# EAGLE design Pressure-Sensor-Module (EAGLE 9.3.1)
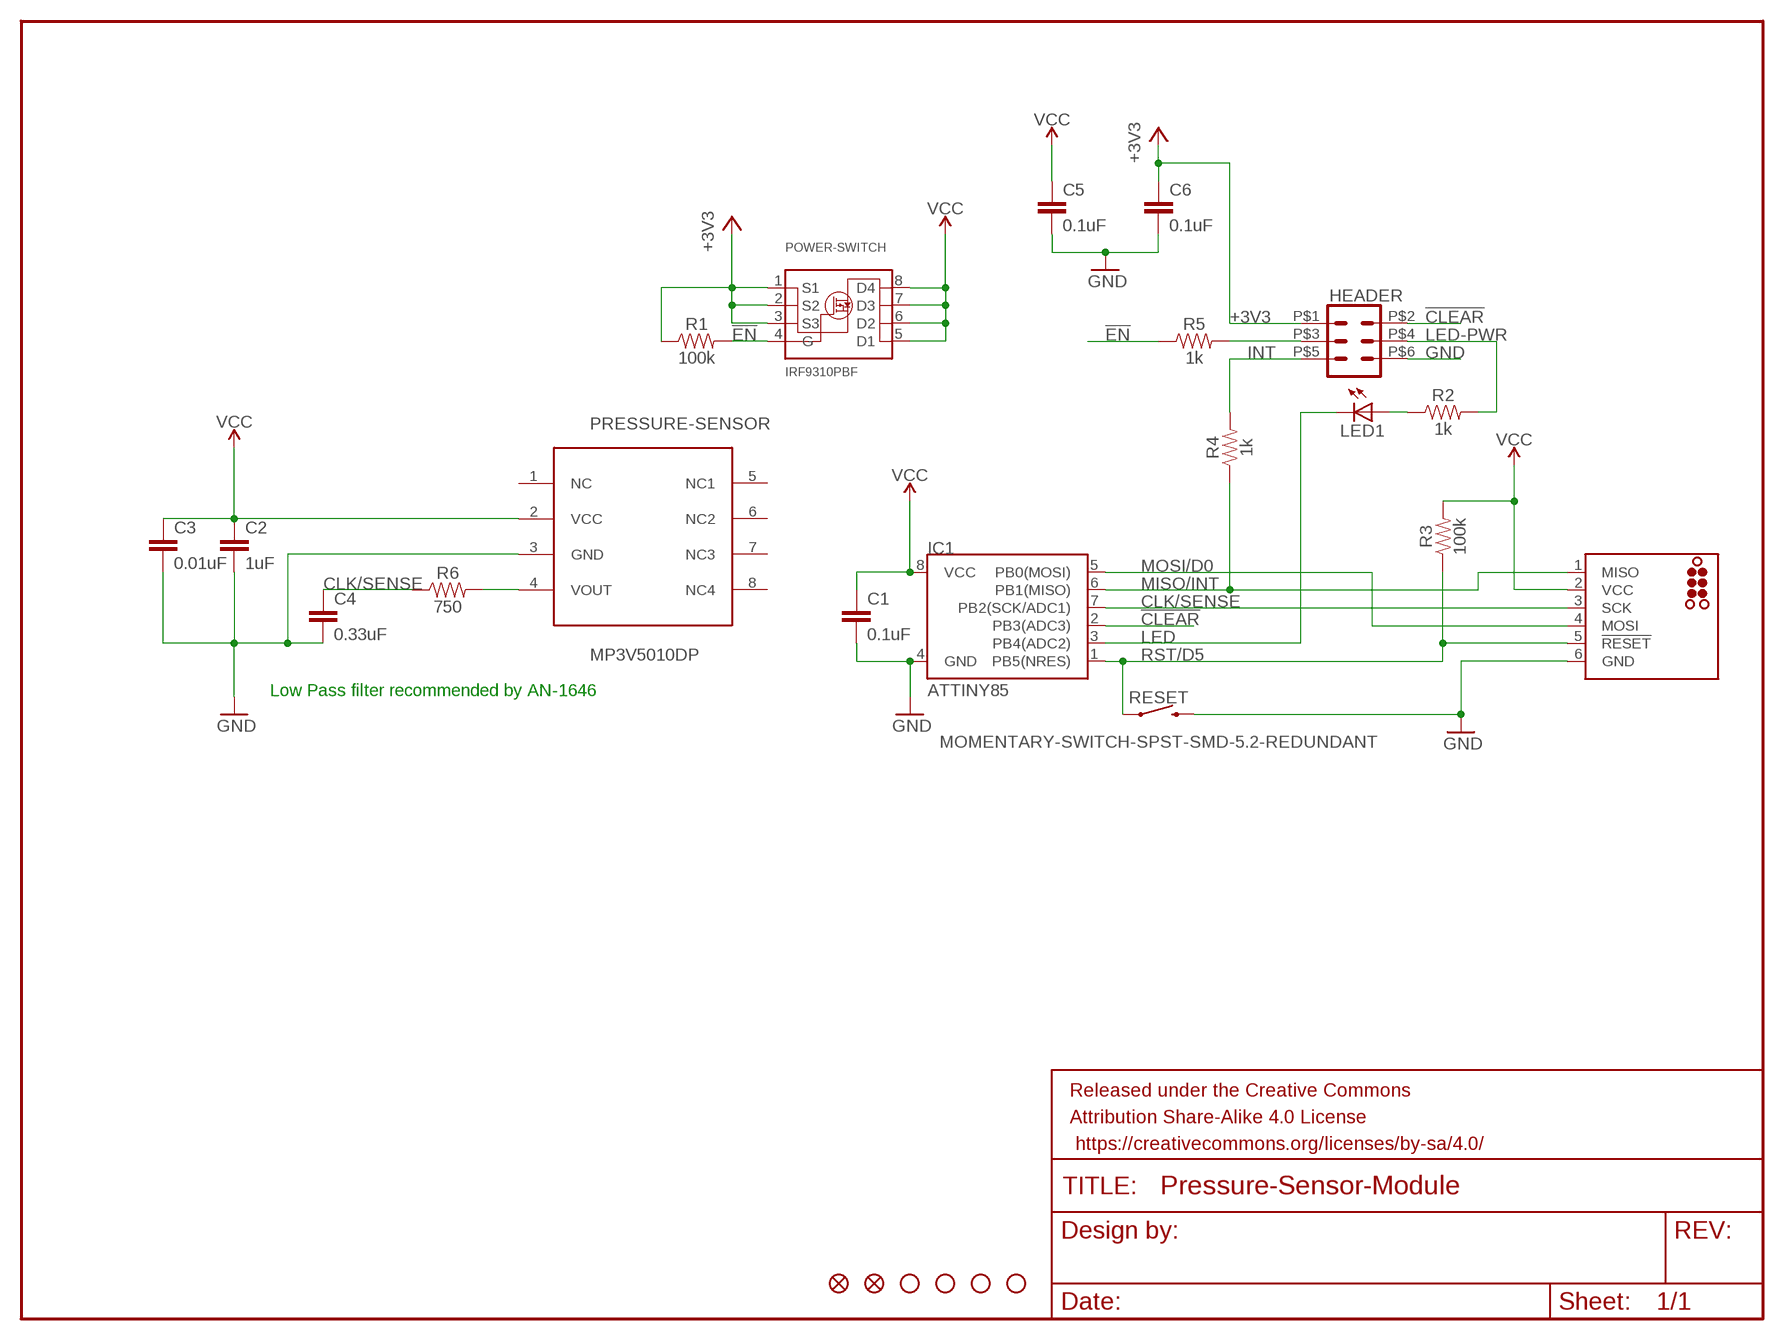
[diagram p0: schematic, sheet 1]

## Parts
C1  0.1uF  1.0UF-0805-25V-10%  [0805]
C2  1uF  1.0UF-0805-25V-10%  [0805]
C3  0.01uF  1.0UF-0805-25V-10%  [0805]
C4  0.33uF  1.0UF-0805-25V-10%  [0805]
C5  0.1uF  1.0UF-0805-25V-10%  [0805]
C6  0.1uF  1.0UF-0805-25V-10%  [0805]
FD1  FIDUCIALUFIDUCIAL  [FIDUCIAL-MICRO]
FD2  FIDUCIALUFIDUCIAL  [FIDUCIAL-MICRO]
FRAME1  FRAME-LETTER  [CREATIVE_COMMONS]
HEADER  CONN_03X2POGO_PINS  [2X3_POGO]
IC1  ATTINY85  ATTINY45  [SO08-EIAJ]
ICSP  TC2030-MCP-NL  [TC2030-MCP-NL]
JP3  STAND-OFF  [STAND-OFF]
JP4  STAND-OFF  [STAND-OFF]
JP5  STAND-OFF  [STAND-OFF]
JP6  STAND-OFF  [STAND-OFF]
LED1  LEDCHIP-LED0805  [CHIP-LED0805]
POWER-SWITCH  IRF9310PBF  [SO8-GW300]
PRESSURE-SENSOR  MP3V5010DP  MP3V5010  [MP3V5010]
R1  100k  0.3OHM-0805-1/8W-1%  [0805]
R2  1k  0.3OHM-0805-1/8W-1%  [0805]
R3  100k  0.3OHM-0805-1/8W-1%  [0805]
R4  1k  0.3OHM-0805-1/8W-1%  [0805]
R5  1k  0.3OHM-0805-1/8W-1%  [0805]
R6  750  0.3OHM-0805-1/8W-1%  [0805]
RESET  MOMENTARY-SWITCH-SPST-SMD-5.2-REDUNDANT  [TACTILE_SWITCH_SMD_5.2MM]

## Nets
!CLEAR!: HEADER.P$2 IC1.2(PB3(ADC3))
!EN!: POWER-SWITCH.4(G) R1.2 R5.1
+3V3: C6.1 HEADER.P$1 POWER-SWITCH.1(S1) POWER-SWITCH.2(S2) POWER-SWITCH.3(S3) R1.1
CLK/SENSE: C4.1 IC1.7(PB2(SCK/ADC1)) ICSP.3(SCK) R6.1
GND: C1.2 C2.2 C3.2 C4.2 C5.2 C6.2 HEADER.P$6 IC1.4(GND) ICSP.6(GND) PRESSURE-SENSOR.3(GND) RESET.3 RESET.4
INT: HEADER.P$5 R4.2
LED: IC1.3(PB4(ADC2)) LED1.C
LED-PWR: HEADER.P$4 R2.2
MISO/INT: IC1.6(PB1(MISO)) ICSP.1(MISO) R4.1
MOSI/D0: IC1.5(PB0(MOSI)) ICSP.4(MOSI)
N$1: LED1.A R2.1
N$2: HEADER.P$3 R5.2
N$3: PRESSURE-SENSOR.4(VOUT) R6.2
RST/D5: IC1.1(PB5(NRES)) ICSP.5(!RESET) R3.1 RESET.1 RESET.2
VCC: C1.1 C2.1 C3.1 C5.1 IC1.8(VCC) ICSP.2(VCC) POWER-SWITCH.5(D1) POWER-SWITCH.6(D2) POWER-SWITCH.7(D3) POWER-SWITCH.8(D4) PRESSURE-SENSOR.2(VCC) R3.2
Unconnected: PRESSURE-SENSOR.6(NC2) PRESSURE-SENSOR.7(NC3) PRESSURE-SENSOR.8(NC4)

## Notes on the sheet
- Low Pass filter recommended by AN-1646

## Power pins joined to a net without a drawn wire
NC: PRESSURE-SENSOR.1(NC)
NC1: PRESSURE-SENSOR.5(NC1)

## Library data of the parts
C1-C6 = SparkFun-Capacitors:1.0UF: 1µF ceramic capacitors A capacitor is a passive two-terminal electrical component used to store electrical energy temporarily in an electric field.; PROD_ID: CAP-08064; VALUE: 1.0uF
FD1 FD2 = SparkFun-Aesthetics:FIDUCIAL: Fiducial Alignment Points Point-of-reference for pick-and-place machines and other optical instruments.
FRAME1 = SparkFun-Aesthetics:FRAME-LETTER: Schematic Frame - Letter Standard 8.5x11 US Letter frame
HEADER = SparkFun-Connectors:CONN_03X2: Multi connection point. Often used as Generic Header-pin footprint for 0.1 inch spaced/style header connections You can populate with any combo of single row headers, but if you'd like an exact match, check these: Header - 2x3 (Male, 0.1") <https://www.sparkfun.com/products/12807> (PRT-12807) Header - 2x3 (Female, 0.1") <https://www.sparkfun.com/products/13010> (PRT-13010) 2x3 Pin Shrouded Header <https://www.sparkfun.com/products/10877> (PRT-10877) On any of the 0.1 inch spaced packages, you can populate with these: Break Away Headers - Straight <https://www.sparkfun.com/products/116> (PRT-00116) Break Away Male Headers - Right Angle <https://www.sparkfun.com/products/553> (PRT-00553) Female Headers <https://www.sparkfun.com/products/115> (PRT-00115) Break Away Headers - Machine Pin <https://www.sparkfun.com/products/117> (PRT-00117) Break Away Female Headers - Swiss Machine Pin <https://www.sparkfun.com/products/743> (PRT-00743) Special note: the shrouded connector mates well with our 3x2 ribbon cables: Ribbon Crimp Connector - 6-pin (2x3, Female) <https://www.sparkfun.com/products/10651> (PRT-10651) Ribbon Cable - 6 wire (15ft) <https://www.sparkfun.com/products/10646> (PRT-10646); PROD_ID: HW-11044
IC1 = SparkFun:ATTINY45: Atmel ATTiny45
ICSP = tag-connect:TC2030: TAG-CONNECT ICSP Connector Manufacturer: Tag-Connect <http://www.tag-connect.com> Cable for easy In-Circuit Serial Programming. Designed for Microchip ICD2, suitable for many others. Two variants - one "with legs" (for hands-free fit on PCB) and another "without legs" for quick programming. PAD Description 1 MCLR/Vpp 2 Vdd 3 GND 4 PGD (ISPDAT) 5 PGC (ISPCLK) 6 nc (used for LVP) ©2009 ROFA.cz - modified and updated by Robert Darlington ‹rdarlington@gmail.com›
JP3-JP6 = SparkFun:STAND-OFF: Stand Off This is the mechanical footprint for a #4 phillips button head screw. Use the keepout ring to avoid running the screw head into surrounding components. SKU : PRT-00447
LED1 = adafruit:LED: LED OSRAM: - CHIPLED LG R971, LG N971, LY N971, LG Q971, LY Q971, LO R971, LY R971 LH N974, LH R974 LS Q976, LO Q976, LY Q976 LO Q996 - Hyper CHIPLED LW Q18S LB Q993, LB Q99A, LB R99A - SideLED LS A670, LO A670, LY A670, LG A670, LP A670 LB A673, LV A673, LT A673, LW A673 LH A674 LY A675 LS A676, LA A676, LO A676, LY A676, LW A676 LS A679, LY A679, LG A679 - Hyper Micro SIDELED® LS Y876, LA Y876, LO Y876, LY Y876 LT Y87S - SmartLED LW L88C, LW L88S LB L89C, LB L89S, LG L890 LS L89K, LO L89K, LY L89K LS L896, LA L896, LO L896, LY L896 - TOPLED LS T670, LO T670, LY T670, LG T670, LP T670 LSG T670, LSP T670, LSY T670, LOP T670, LYG T670 LG T671, LOG T671, LSG T671 LB T673, LV T673, LT T673, LW T673 LH T674 LS T676, LA T676, LO T676, LY T676, LB T676, LH T676, LSB T676, LW T676 LB T67C, LV T67C, LT T67C, LS T67K, LO T67K, LY T67K, LW E67C LS E67B, LA E67B, LO E67B, LY E67B, LB E67C, LV E67C, LT E67C LW T67C LS T679, LY T679, LG T679 LS T770, LO T770, LY T770, LG T770, LP T770 LB T773, LV T773, LT T773, LW T773 LH T774 LS E675, LA E675, LY E675, LS T675 LS T776, LA T776, LO T776, LY T776, LB T776 LHGB T686 LT T68C, LB T68C - Hyper Mini TOPLED® LB M676 - Mini TOPLED Santana® LG M470 LS M47K, LO M47K, LY M47K Source: http://www.osram.convergy.de/
POWER-SWITCH = MOSFETs:IRF9310PBF: IRF9310P P-MOSFET. Specifications from: http://www.irf.com/product-info/datasheets/data/irf9310pbf.pdf by Chip McClelland chip@mcclellands.org
PRESSURE-SENSOR = Custom Components:MP3V5010
R1-R6 = SparkFun-Resistors:0.3OHM: 0.3Ω resistor A resistor is a passive two-terminal electrical component that implements electrical resistance as a circuit element. Resistors act to reduce current flow, and, at the same time, act to lower voltage levels within circuits. - Wikipedia; PROD_ID: RES-11622; VALUE: 0.3
RESET = SparkFun-Switches:MOMENTARY-SWITCH-SPST: Momentary Switch (Pushbutton) - SPST Normally-open (NO) SPST momentary switches (buttons, pushbuttons). Variants PTH-12MM - 12mm square, through-hole Momentary Pushbutton Switch - 12mm Square <https://www.sparkfun.com/products/9190> (COM-09190) PTH-6.0MM, PTH-6.0MM-KIT - 6.0mm square, through-hole Mini Pushbutton Switch <https://www.sparkfun.com/products/97> (COM-00097) KIT package intended for soldering kit's - only one side of pads' copper is exposed. PTH-RIGHT-ANGLE-KIT - Right-angle, through-hole Right Angle Tactile Button <https://www.sparkfun.com/products/10791> - Used on SparkFun BigTime Watch Kit <https://www.sparkfun.com/products/11734> SMD-12MM - 12mm square, surface-mount Tactile Button - SMD (12mm) <https://www.sparkfun.com/products/12993> (COM-12993) Used on SparkFun PicoBoard <https://www.sparkfun.com/products/11888> SMD-4.5MM - 4.5mm Square Trackball Switch Used on SparkFun Blackberry Trackballer Breakout <https://www.sparkfun.com/products/13169> SMD-4.6MMX2.8MM - 4.60mm x 2.80mm, surface mount Used on SparkFun SAMD21 Mini Breakout <https://www.sparkfun.com/products/13664> SMD-5.2MM, SMD-5.2-REDUNDANT - 5.2mm square, surface-mount Mini Pushbutton Switch - SMD <https://www.sparkfun.com/products/8720> (COM-08720) Used on Arduino Pro Mini <https://www.sparkfun.com/products/11114> REDUNDANT package connects both switch circuits together SMD-6.0X3.5MM - 6.0 x 3.5mm, surface mount Momentary Reset Switch SMD <https://www.sparkfun.com/products/8229> (COM-08229) SMD-6.2MM-TALL - 6.2mm square, surface mount Tactile Button - SMD (6mm) <https://www.sparkfun.com/products/12992> Used on SparkFun Digital Sandbox <https://www.sparkfun.com/products/12651> SMD-RIGHT-ANGLE - Right-angle, surface mount Used on SparkFun Block for Intel® Edison - Arduino <https://www.sparkfun.com/products/13036>; PROD_ID: SWCH-08247; SF_SKU: COM-08720

## Board
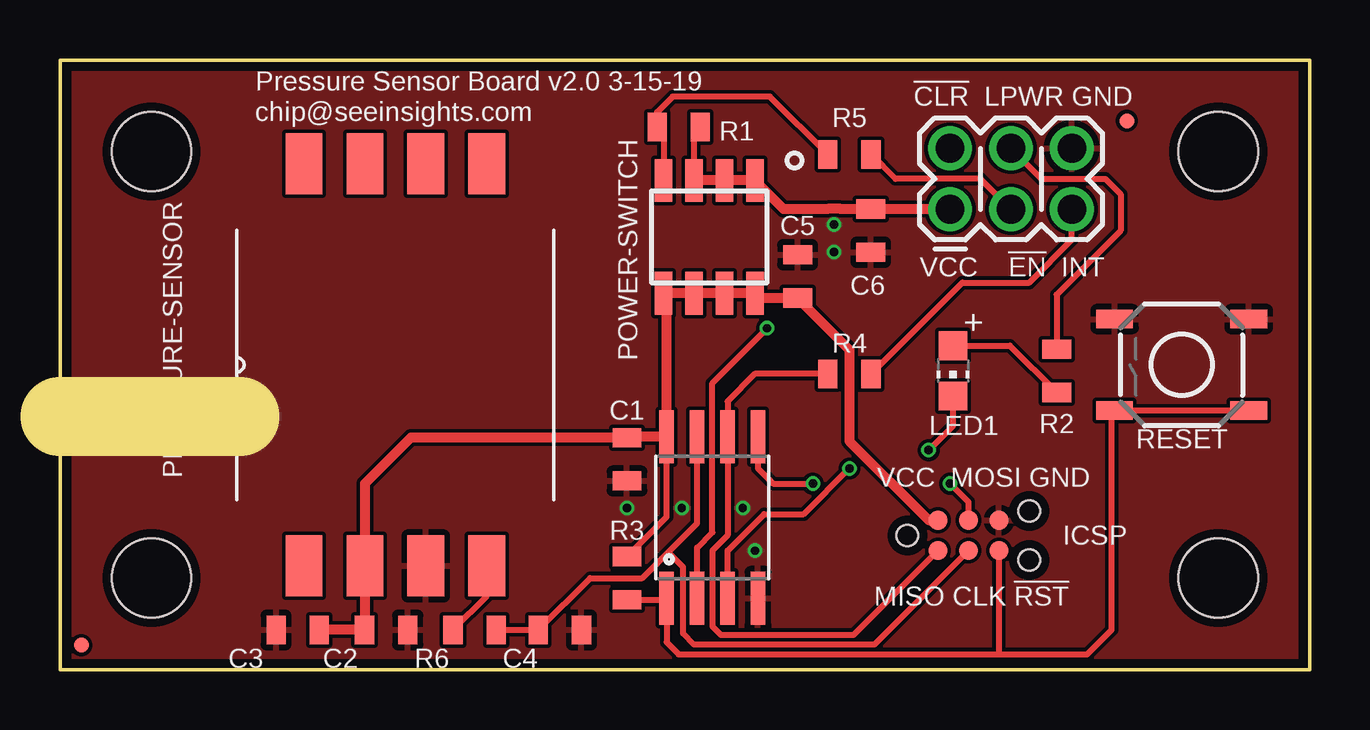
[diagram p1: board, top side]
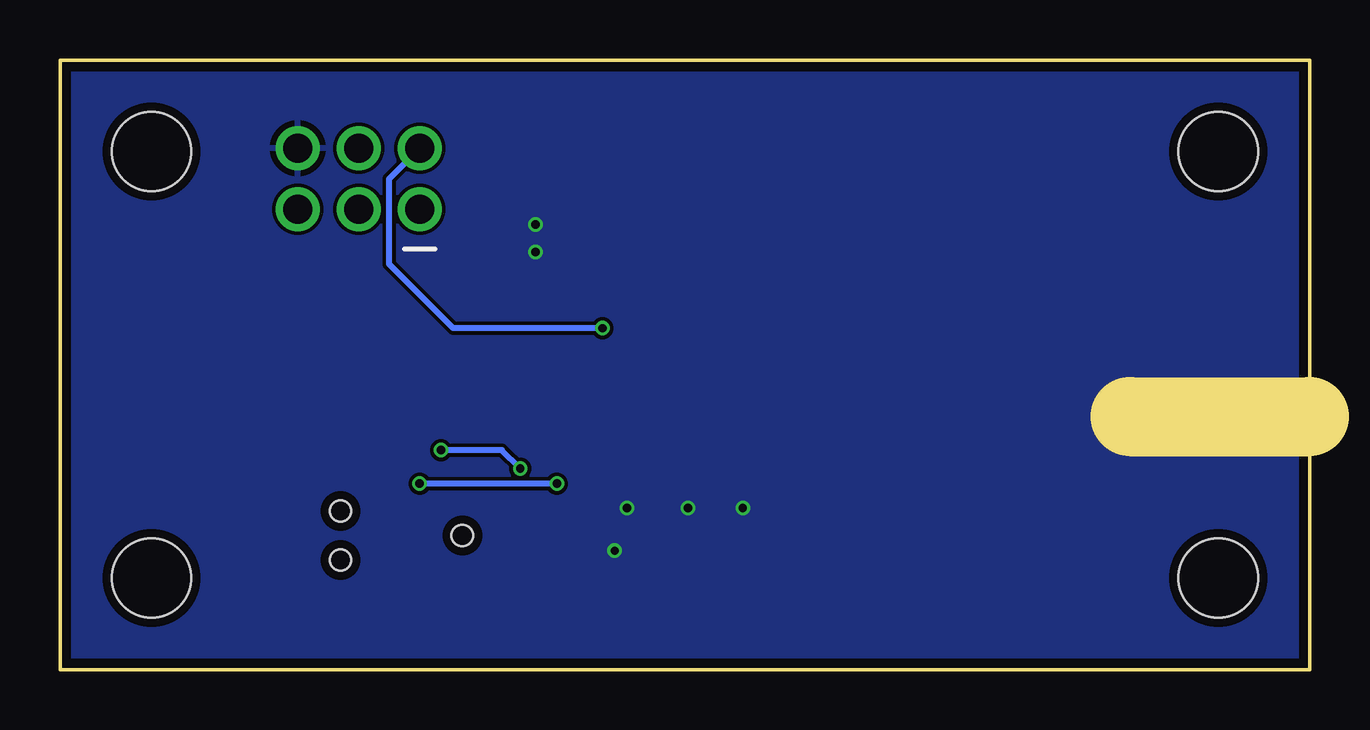
[diagram p2: board, bottom side, seen from below]

Size 52.07 x 25.4 mm. Coordinates in mm from the lower left corner, seen from the top.
Outline: 0,0 52.07,0 52.07,25.4 0,25.4 0,0
Copper layers (1*16): Top 0.035559375mm / dielectric 1.6mm / Bottom 0.035559375mm
Design rules "oshpark-2layer": minimum track width 6mil, minimum drill 10mil, track to track 6mil, track to pad 6mil, pad to pad 6mil, via to via 6mil, smd to smd 6mil, copper to edge 15mil, drill to drill 6mil, minimum pad ring 5mil, minimum via ring 5mil, stop-mask expansion 2.5mil, vias tented up to drill 0mil, thermal gap 10mil
Milling: 1 lines

### Footprints (pad centres in the part's own frame; a part is rotated, then mirrored left to right if it is on the bottom)
0805 = smd 0.8 x 1.2: 1 -0.9,0; 2 0.9,0
FIDUCIAL-MICRO = smd 0.635 x 0.635: 1 0,0
2X3_POGO = drill 1.2 pad 1.829: P$1 0,0; P$2 0,2.54; P$3 2.54,0; P$4 2.54,2.54; P$5 5.08,0; P$6 5.08,2.54
SO08-EIAJ = smd 0.61 x 2.21: 1 -1.905,-3.378; 2 -0.635,-3.378; 3 0.635,-3.378; 4 1.905,-3.378; 5 1.905,3.353; 6 0.635,3.353; 7 -0.635,3.353; 8 -1.905,3.353
TC2030-MCP-NL = smd 0.787 x 0.787: 1 1.27,-0.635; 2 1.27,0.635; 3 2.54,-0.635; 4 2.54,0.635; 5 3.81,-0.635; 6 3.81,0.635 | hole 0.889: 0,0; 5.08,-1.016; 5.08,1.016
STAND-OFF = hole 3.302: 0,0
CHIP-LED0805 = smd 1.2 x 1.2: A 0,-1.05; C 0,1.05
SO8-GW300 = smd 1.78 x 0.72: 1 -2.349,1.905; 2 -2.349,0.635; 3 -2.349,-0.635; 4 -2.349,-1.905; 5 2.349,-1.905; 6 2.349,-0.635; 7 2.349,0.635; 8 2.349,1.905
MP3V5010 = smd 2.54 x 1.524: 1 -8.382,3.81; 2 -8.382,1.27; 3 -8.382,-1.27; 4 -8.382,-3.81; 5 8.382,-3.81; 6 8.382,-1.27; 7 8.382,1.27; 8 8.382,3.81
TACTILE_SWITCH_SMD_5.2MM = smd 1.524 x 0.762: 1 -2.794,1.905; 2 2.794,1.905; 3 -2.794,-1.905; 4 2.794,-1.905

### Placement (x,y rotation side)
C1  23.62,8.76 270 top
C2  13.59,1.65 0 top
C3  9.91,1.65 180 top
C4  20.83,1.65 0 top
C5  30.73,16.38 90 top
C6  33.78,18.29 270 top
FD1  44.45,22.86 0 top
FD2  0.89,1.02 0 top
FRAME1  16.51,-12.7 0 top  (outside the outline)
HEADER  37.08,19.18 0 top
IC1  27.18,6.35 0 top
ICSP  35.31,5.59 0 top
JP3  3.81,21.59 0 top
JP4  3.81,3.81 0 top
JP5  48.26,21.59 0 top
JP6  48.26,3.81 0 top
LED1  37.21,12.45 180 top
POWER-SWITCH  27.05,18.03 270 top
PRESSURE-SENSOR  13.97,12.7 90 top
R1  25.78,22.61 180 top
R2  41.53,12.45 90 top
R3  23.62,3.81 90 top
R4  32.89,12.32 0 top
R5  32.89,21.46 0 top
R6  17.27,1.65 180 top
RESET  46.74,12.7 180 top

### Tracks (layer width: path | path; a pad name or v marks a point on that pad's centre or on a via)
!CLEAR!  (via drill 0.35)
  Top 0.254: IC1.2 26.54,5.08 27.18,5.71 27.18,11.94 v29.46,14.22
  Bottom 0.254: v29.46,14.22 35.69,14.22 38.35,16.89 38.35,20.45 HEADER.P$2
!EN!
  Top 0.254: POWER-SWITCH.4 25.15,22.34 R1.2 24.88,23.23 25.53,23.88 29.58,23.88 R5.1
+3V3
  Top 0.254: R1.1 26.42,22.34 POWER-SWITCH.3
  Top 0.406: HEADER.P$1 33.79,19.18 C6.1 32.54,19.19 32.53,19.2 31.99,19.2 31.97,19.19 30.15,19.19 POWER-SWITCH.1 POWER-SWITCH.2 POWER-SWITCH.3
CLK/SENSE
  Top 0.254: R6.1 C4.1 22.09,3.81 24.26,3.81 25.34,4.89 | 25.34,4.89 26.54,6.1 IC1.7 | ICSP.3 33.93,1.04 26.42,1.04 25.96,1.5 25.96,4.27 25.34,4.89
GND  (via drill 0.35)
  other vias: 23.62,6.73 28.96,4.95 32.26,17.4 32.26,18.54 25.91,6.73 28.45,6.73
  pour Top: -1.27,26.67 57.66,26.67 57.66,-1.27 -1.27,-1.27
  pour Bottom: -1.27,26.67 59.44,26.67 59.44,-1.27 -1.27,-1.27
INT
  Top 0.254: R4.2 37.6,16.13 40.39,16.13 42.16,17.91 HEADER.P$5
LED  (via drill 0.35)
  Top 0.254: IC1.3 27.81,4.95 29.34,6.48 30.99,6.48 v32.89,8.38 | v36.2,9.14 37.21,10.16 LED1.C
  Bottom 0.254: v32.89,8.38 33.66,9.14 v36.2,9.14
LED-PWR
  Top 0.254: HEADER.P$4 40.89,20.45 43.56,20.45 44.2,19.81 44.2,18.29 41.53,15.62 R2.2
MISO/INT
  Top 0.254: ICSP.1 33.07,1.45 27.53,1.45 27.18,1.8 27.18,4.95 27.81,5.59 IC1.6 27.81,11.18 28.96,12.32 R4.1
MOSI/D0  (via drill 0.35)
  Top 0.254: IC1.5 29.08,8.38 29.72,7.75 v31.37,7.75 | v37.08,7.75 37.85,6.99 ICSP.4
  Bottom 0.254: v31.37,7.75 v37.08,7.75
N$1
  Top 0.254: LED1.A 39.58,13.5 R2.1
N$2
  Top 0.254: HEADER.P$3 38.35,20.45 34.81,20.45 R5.2
N$3
  Top 0.254: PRESSURE-SENSOR.4 17.78,3.06 R6.2
RST/D5
  Top 0.254: RESET.1 RESET.2 43.81,10.67 43.81,1.65 42.8,0.64 39.12,0.64 | R3.1 25.21,2.91 IC1.1 25.27,1.14 25.78,0.64 39.12,0.64 | ICSP.5 39.12,0.64
VCC
  Top 0.254: R3.2 25.27,6.36 IC1.8
  Top 0.406: ICSP.2 36.2,6.22 32.89,9.53 32.89,13.32 C5.1 29.16,15.48 POWER-SWITCH.8 POWER-SWITCH.7 POWER-SWITCH.6 POWER-SWITCH.5 25.27,15.56 IC1.8 23.66,9.7 C1.1 14.62,9.66 12.7,7.75 PRESSURE-SENSOR.2 12.7,1.66 C2.1 C3.1

### Text on the board
tNames: Pressure Sensor Board v2.0 3-15-19 | chip@seeinsights.com | !CLR! LPWR GND | VCC !EN! INT | VCC MOSI GND | MISO CLK !RST